# Altium schematic sheet 1_MH-CD42_v1.schdoc
size 419 x 302 mm; Name: C:\Users\Public\Documents\Altium\AD21\TemplatesNew\Формат_A3_Горизонт_лист1.SchDot; Symbol: C:\Users\Public\Documents\Altium\AD21\TemplatesNew\Формат_A3_Горизонт_лист1.SchDot; Device: C:\Users\Public\Documents\Altium\AD21\TemplatesNew\Формат_A3_Горизонт_лист1.SchDot; @Create Time: 01:23:20; @Update Time: 21:51:46; @Page No: 1; @Page Count: 1; @Schematic Name: MH-CD42_v1; @Project Name: MH-CD42; @Board Name: MH-CD42_v1; @Update Date: 2025-03-19; @Page Name: MH-CD42_v1; @Create Date: 2025-03-19
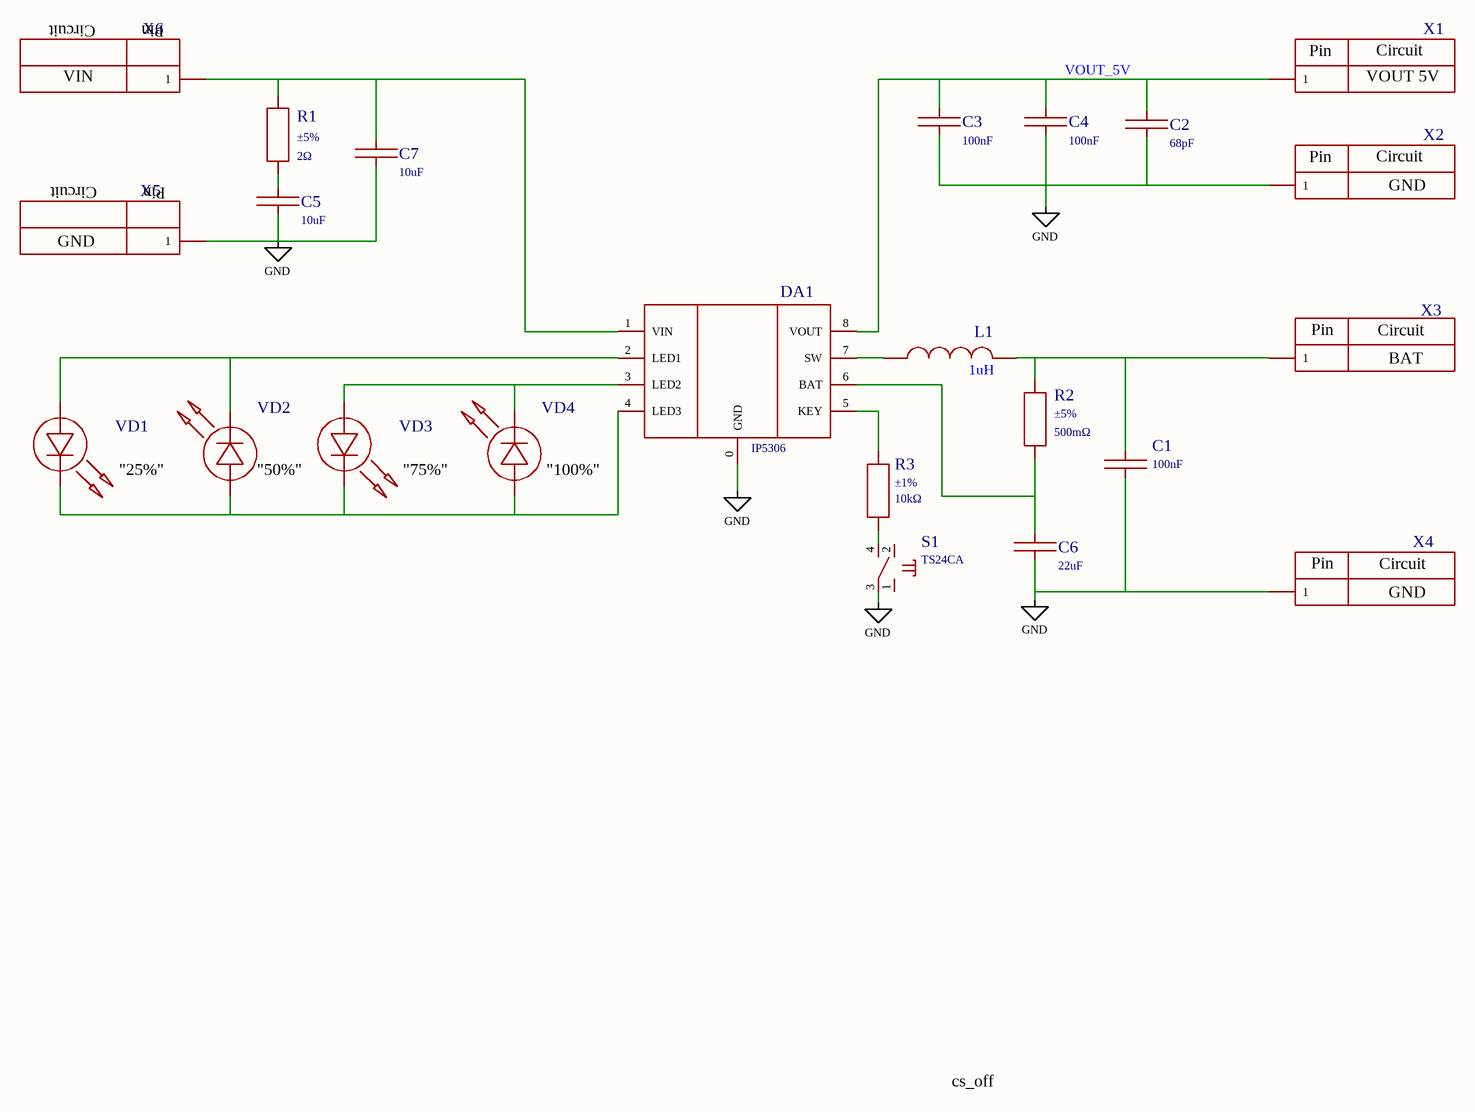
[diagram p0: 1_MH-CD42_v1.schdoc]

## Parts
C1  100nF  [C1206C]
C2  68pF  [C0603C]
C3  100nF  [C1206C]
C4  100nF  [C1206C]
C5  10uF  [C1206C]
C6  22uF  [C1206C]
C7  10uF  [C1206C]
DA1  IP5306  [8-SOIC-PAD]
L1  1uH  [IND-SMD_L7.0-W6.6]  (value not drawn)
R1  Tolerance: ±5%  [RES: 0603]  (hidden comment: 2Ω)
R2  Tolerance: ±5%  [RES: 0603]  (hidden comment: 500mΩ)
R3  Tolerance: ±1%  [RES: 0603]  (hidden comment: 10kΩ)
S1  TS24CA  [BUT: TS24CA]
VD1  D-R080508L3-KS2  [LED: 0805G]  (value not drawn)
VD2  D-R080508L3-KS2  [LED: 0805G]  (value not drawn)
VD3  D-R080508L3-KS2  [LED: 0805G]  (value not drawn)
VD4  D-R080508L3-KS2  [LED: 0805G]  (value not drawn)
X1  SMT PAD  (value not drawn)
X2  SMT PAD  (value not drawn)
X3  SMT PAD  (value not drawn)
X4  SMT PAD  (value not drawn)
X5  SMT PAD  (value not drawn)
X6  SMT PAD  (value not drawn)

## Nets
GND: C1.2 C2.2 C3.2 C4.2 C5.2 C6.2 C7.2 DA1.0(GND) S1.3 X2.1 X4.1 X5.1
VOUT_5V: C2.1 C3.1 C4.1 DA1.8(VOUT) X1.1
NetC1_1: C1.1 L1.1 R2.2 X3.1
NetC5_1: C5.1 R1.1
NetC6_1: C6.1 DA1.6(BAT) R2.1
NetC7_1: C7.1 DA1.1(VIN) R1.2 X6.1
NetDA1_2: DA1.2(LED1) VD1.1(A) VD2.2(C)
NetDA1_3: DA1.3(LED2) VD3.1(A) VD4.2(C)
NetDA1_4: DA1.4(LED3) VD1.2(C) VD2.1(A) VD3.2(C) VD4.1(A)
NetDA1_5: DA1.5(KEY) R3.2
NetDA1_7: DA1.7(SW) L1.2
NetR3_1: R3.1 S1.4

Not connected (* = marked no-connect by the designer): S1 1 2

## Notes on the sheet
- VIN
- VOUT 5V
- GND
- BAT
- (near L1) 1uH
- "25%"
- (near VD2) "50%"
- "75%"
- (near VD4) "100%"
- cs_off
- MH-CD42_v1
- Перв. примен.
- Справ. №
- Подп. и дата
- Инв. № дубл.
- Взам. инв. №
- Лит.
- Масса
- Масштаб
- Разраб.
- Пров.
- Изм.
- Лист
- № докум.
- Подп.
- Дата
- MH-CD42
- Т. контр.
- SCH
- Листов
- 1
- Н. контр.
- Утв.
- Копировал
- Формат А3
- (in symbol =TypeConnector+', '+VoltageMax+', '+CurrentMax) Pin; Circuit

## Library data of the parts
C1 C3 C4 = CL31B104KBCNFNC: Manufacturer: SAMSUNG(三星); Symbol: Cap; Add into BOM: yes; Tolerance: ±10%; Device: CL31B104KBCNFNC; LCSC Part Name: 100nF ±10% 50V; Supplier Part: C346231; Manufacturer Part: CL31B104KBCNFNC; Supplier Footprint: 1206; JLCPCB Part Class: Extended Part; Supplier: LCSC; Convert to PCB: yes; Value: 100nF
C2 = CL10C680JB8NNNC: Manufacturer: SAMSUNG(三星); Symbol: Cap; Add into BOM: yes; Tolerance: ±5%; Device: CL10C680JB8NNNC; LCSC Part Name: 68pF ±5% 50V; Supplier Part: C28262; Manufacturer Part: CL10C680JB8NNNC; Supplier Footprint: 0603; JLCPCB Part Class: Extended Part; Datasheet: https://atta.szlcsc.com/upload/public/pdf/source/20160218/1457707763339.pdf; Supplier: LCSC; Convert to PCB: yes; Value: 68pF
C5 C7 = CL31A106KBHNNNE: Manufacturer: SAMSUNG(三星); Symbol: Cap; Add into BOM: yes; Tolerance: ±10%; Device: CL31A106KBHNNNE; LCSC Part Name: 10uF ±10% 50V; Supplier Part: C13585; Manufacturer Part: CL31A106KBHNNNE; Supplier Footprint: 1206; JLCPCB Part Class: Basic Part; Datasheet: https://atta.szlcsc.com/upload/public/pdf/source/20160218/1457707763339.pdf; Supplier: LCSC; Convert to PCB: yes; Value: 10uF
C6 = CL31A226KAHNNNE: Manufacturer: SAMSUNG(三星); Symbol: Cap; Add into BOM: yes; Tolerance: ±10%; Device: CL31A226KAHNNNE; LCSC Part Name: 22uF ±10% 25V; Supplier Part: C12891; Manufacturer Part: CL31A226KAHNNNE; Supplier Footprint: 1206; JLCPCB Part Class: Basic Part; Datasheet: https://atta.szlcsc.com/upload/public/pdf/source/20160218/1457707763339.pdf; Supplier: LCSC; Convert to PCB: yes; Value: 22uF
DA1 = IP5306: Manufacturer: INJOINIC(英集芯); Symbol: IP5306_SO8; Add into BOM: yes; Device: IP5306; LCSC Part Name: IP5306; Supplier Part: C181692; Manufacturer Part: IP5306; Supplier Footprint: ESOP-8; JLCPCB Part Class: Extended Part; Datasheet: https://atta.szlcsc.com/upload/public/pdf/source/20190627/C384572_9925B3DDC4041BC6108E5AB46A2A0AB1.pdf; Supplier: LCSC; Convert to PCB: yes
L1 = APH0630T1R0M: Manufacturer: APV(爱普微); Symbol: Inductor_SMD_AMPLF_0630; Add into BOM: yes; Tolerance: ±20%; Rated Current: 10.73A; Saturation Current (Isat): 12.45A; Type: Integrated molded inductor; Device: APH0630T1R0M; LCSC Part Name: 1uH ±20% 12.45A; Supplier Part: C5349700; Manufacturer Part: APH0630T1R0M; Supplier Footprint: SMD,7x6.6mm; JLCPCB Part Class: Extended Part; Datasheet: https://atta.szlcsc.com/upload/public/pdf/source/20240422/44C6AF90C0CE08E50D7C2708B16BB974.pdf; Supplier: LCSC; Convert to PCB: yes; Value: 1uH; Ratings: -
R1 = 0603WAJ020JT5E: Manufacturer: UNI-ROYAL(厚声); Symbol: Resistor_0603; Add into BOM: yes; Temperature Coefficient: ±200ppm/℃; Device: 0603WAJ020JT5E; LCSC Part Name: 2Ω ±5% 100mW 厚膜电阻; Supplier Part: C25225; Manufacturer Part: 0603WAJ020JT5E; Supplier Footprint: 0603; JLCPCB Part Class: Extended Part; Datasheet: https://atta.szlcsc.com/upload/public/pdf/source/20200306/C422600_1E6D84923E4A46A82E41ADD87F860B5C.pdf; Supplier: LCSC; Convert to PCB: yes; Type: Thick Film Resistors; Value: 2Ω; Operating Temperature Range: -55℃~+155℃
R2 = FRL0603JR500TS: Manufacturer: FOJAN(富捷); Symbol: Resistor_0603; Add into BOM: yes; Temperature Coefficient: ±300ppm/℃; Device: FRL0603JR500TS; LCSC Part Name: 500mΩ ±5% 100mW 厚膜电阻; Supplier Part: C2930046; Manufacturer Part: FRL0603JR500TS; Supplier Footprint: 0603; JLCPCB Part Class: Extended Part; Datasheet: https://atta.szlcsc.com/upload/public/pdf/source/20211221/925EC7D7225764EE0046F22065062C87.pdf; Supplier: LCSC; Convert to PCB: yes; Type: Thick Film Resistors; Value: 500mΩ; Operating Temperature Range: -55℃~+155℃
R3 = 0603WAF1002T5E: Manufacturer: UNI-ROYAL(厚声); Symbol: Resistor_0603; Add into BOM: yes; Temperature Coefficient: ±100ppm/℃; Device: 0603WAF1002T5E; LCSC Part Name: 厚膜电阻 10kΩ ±1% 100mW; Supplier Part: C25804; Manufacturer Part: 0603WAF1002T5E; Supplier Footprint: 0603; JLCPCB Part Class: Basic Part; Datasheet: https://atta.szlcsc.com/upload/public/pdf/source/20200306/C422600_1E6D84923E4A46A82E41ADD87F860B5C.pdf; Supplier: LCSC; Convert to PCB: yes; Type: Thick Film Resistors; Value: 10kΩ; Operating Temperature Range: -55℃~+155℃
S1 = TS24CA: Manufacturer: SHOU HAN(首韩); Symbol: Кнопка TS24CA; Add into BOM: yes; Circuit: SPST; Actuator Style: Rectangle button; Switch Length: 4.55mm; Switch Width: 1.8mm; Switch Height: 3.5mm; Contact Current: 50mA; Voltage Rating (DC): 12V; Device: TS24CA; LCSC Part Name: 4.55*1.8*3.5mm 卧贴 轻触开关; Supplier Part: C393942; Manufacturer Part: TS24CA; Supplier Footprint: SMD; JLCPCB Part Class: Extended Part; Datasheet: https://atta.szlcsc.com/upload/public/pdf/source/20190521/C393942_591A9E318887EFA4274D34029981AD99.pdf; Supplier: LCSC; Convert to PCB: yes; Mounting Style: 卧贴; With Lamp: -; Mechanical Life: -
VD1-VD4 = D-R080508L3-KS2: Manufacturer: ARKLED(方舟); Symbol: LED_single; Add into BOM: yes; Emitted Color: Red; Device: D-R080508L3-KS2; LCSC Part Name: D-R080508L3-KS2; Supplier Part: C130114; Manufacturer Part: D-R080508L3-KS2; Supplier Footprint: 0805; JLCPCB Part Class: Extended Part; Datasheet: https://atta.szlcsc.com/upload/public/pdf/source/20170919/C130114_1505787182379976884.pdf; Supplier: LCSC; Convert to PCB: yes
X1-X6 = =TypeConnector+', '+VoltageMax+', '+CurrentMax: Symbol: Connector_single_power; TypeConnector: Power connector; CommentText: "Разъем"; Origin Footprint 2: CON: 7781; Origin Footprint 3: CON: 8191; Origin Footprint 4: CON: 7461057; Origin Footprint 5: CON: 7461097; Origin Footprint 6: CON: 7466005R; Origin Footprint 7: CON: TH 2mm; Origin Footprint 8: CON: TH 3.5mm; Origin Footprint 9: CON: Tyco 62650-1; Add into BOM: yes; Origin Footprint 1: CON: TH 1mm; Check: false; Device: TypeConnector+', '+VoltageMax+', '+CurrentMax; Manufacturer: *; HelpURL: *; ValueManufacturerPartNumber: TypeConnector+', '+VoltageMax+', '+CurrentMax; PartNumber: *; VoltageMax: *; CurrentMax: *; Convert to PCB: yes; Design Item ID: Connector_single_power; Library Name: connector